# Altium schematic sheet PWM_Channel.SchDoc
size A
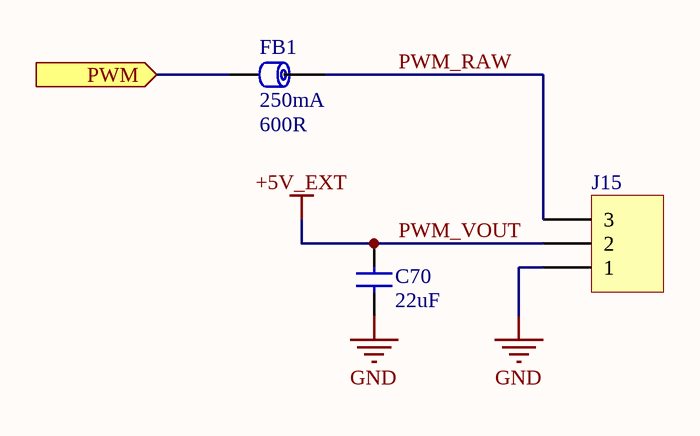
[diagram p0: PWM_Channel.SchDoc]

## Parts
C70  value 22uF  [0805_Capacitor]  (hidden comment: CAP 22uF 16V X5R)
FB1  value 600R  Current Rating: 250mA  [0402_Inductor]  (hidden comment: BK1005HM601-T)
J15  Header 3  [HDR1X3]  (value not drawn)

## Ports
PWM (in)

## Nets
GND: C70.2 J15.1
PWM_VOUT: C70.1 J15.2  [also labelled +5V_EXT]
PWM: FB1.1 ; port PWM
PWM_RAW: FB1.2 J15.3

## Library data of the parts
C70 = C_0805_22uF_16V_20%: CAP CERM 22uF 20% 16V 0805; Package: =SelectedPackage; Voltage: 16V; Temperature Coefficient: X5R; Supplier 1: Digi-Key; Supplier Part Number 1: 1276-6780-6-ND
FB1 = FB_0402_600R_250mA: 600 Ohms @ 100MHz 1 Ferrite Bead 0402 (1005 Metric) 250mA 500mOhm; Manufacturer: Taiyo Yuden; DC Resistance (DCR): 500mR; Frequency: 100MHz; Supplier 1: Digi-Key; Supplier Part Number 1: 490-9702-1-ND; Manufacturer Part Number: BK1005HM601-T; Max Operating Temperature: 125°C; Min Operating Temperature: -55°C
J15 = Header 3: Header, 3-Pin; LatestRevisionDate: 17-Jul-2002; LatestRevisionNote: Re-released for DXP Platform.; Publisher: Altium Limited